# Altium project jarvis.PrjPcb
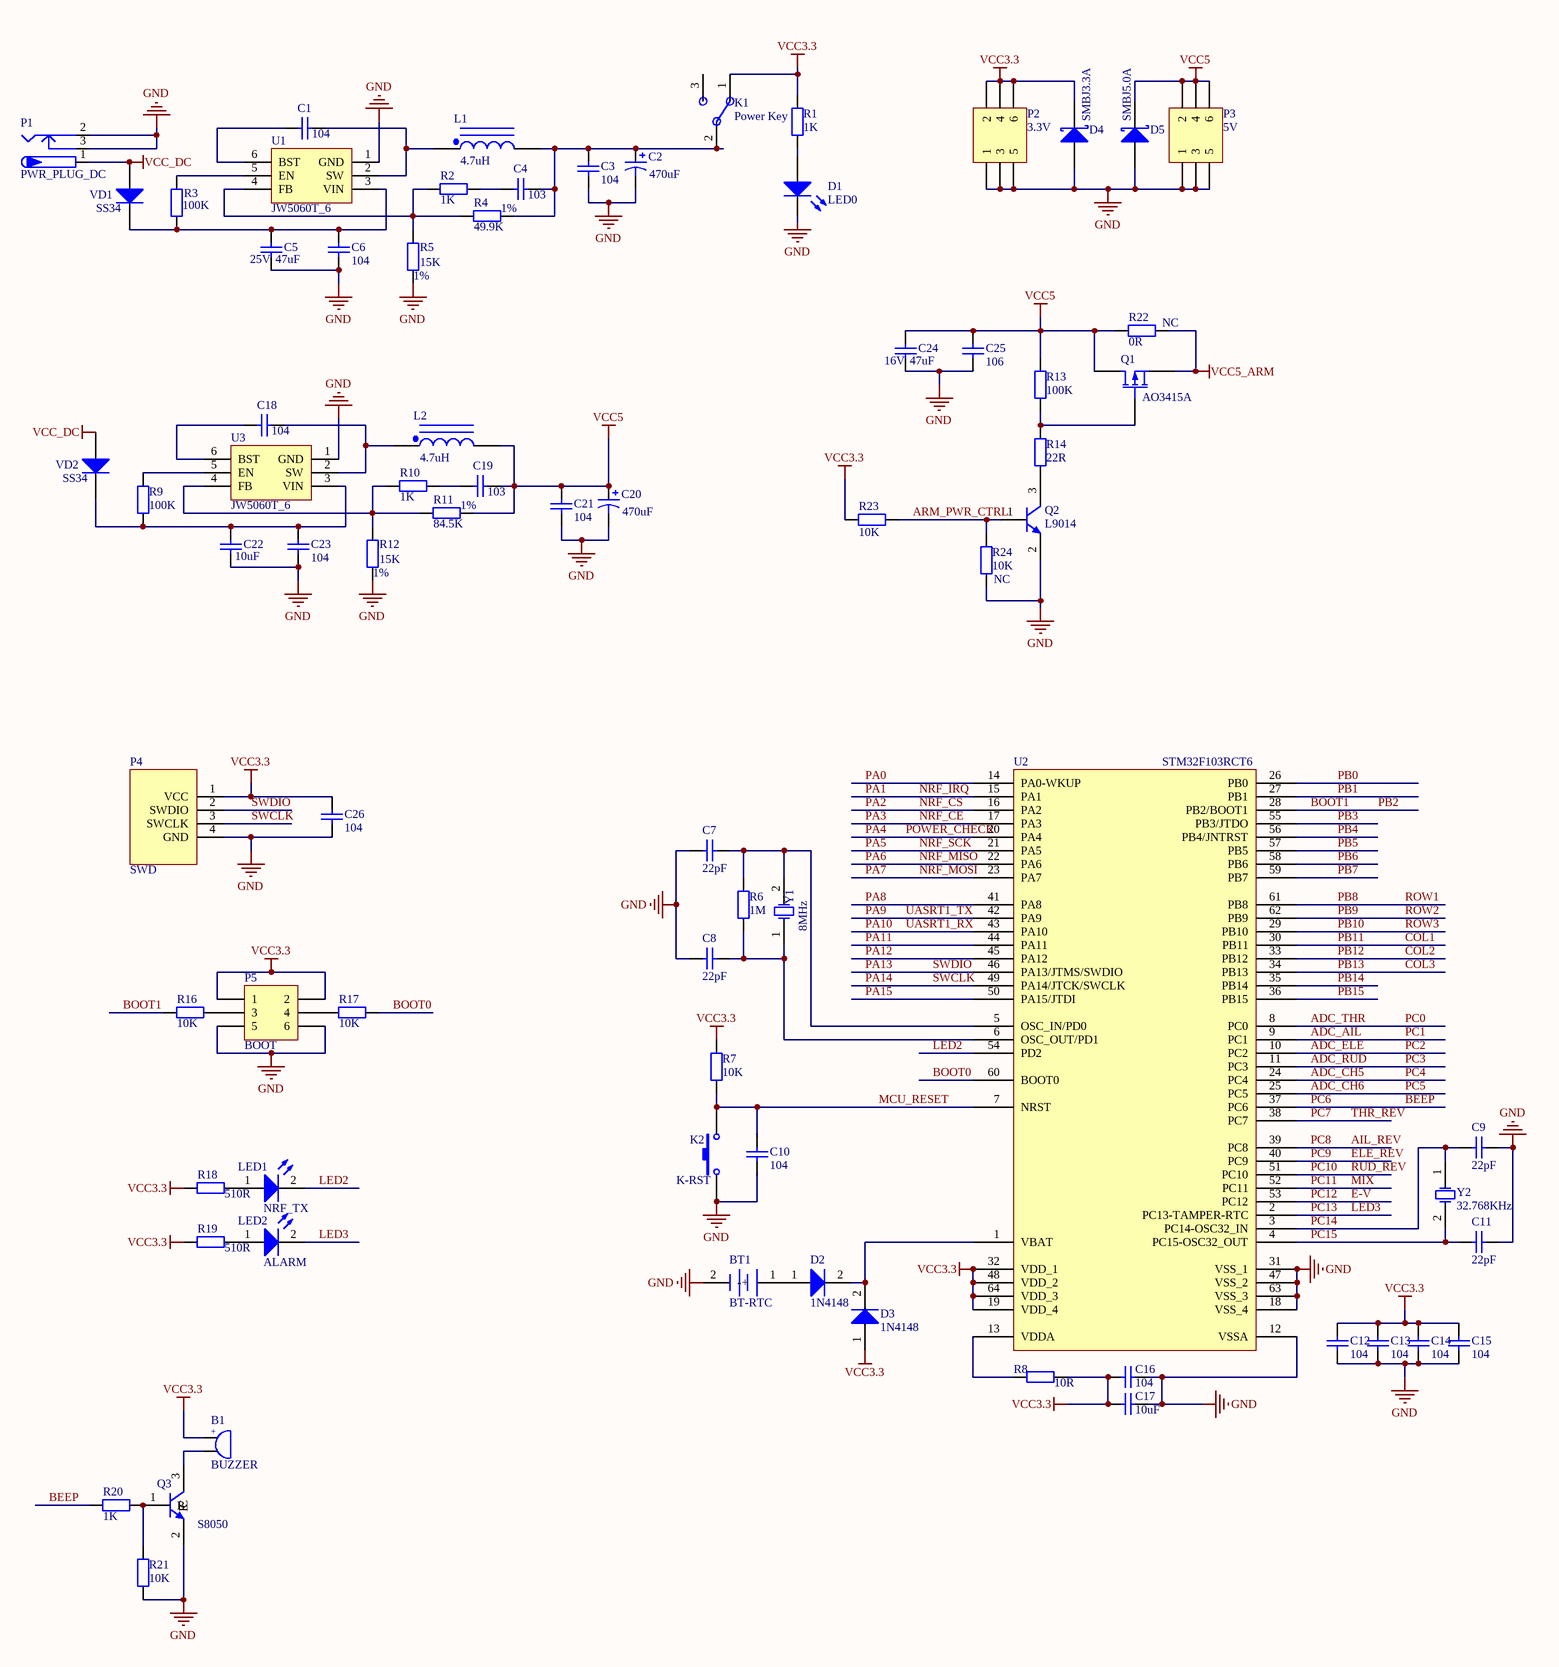
[diagram p0: mcu.SchDoc]
1 sheet, 77 parts. Net scope: global (net labels, ports and power ports of the same name join across sheets).

## Sheet mcu.SchDoc
size A2

### Parts
B1  BUZZER  [BEEP 5x9x5.5]
BT1  BT-RTC  [BAT-RTC]
C1  value 104  [RAD-0.3]  (hidden comment: *)
C2  value 470uF  [RB7.6-15]  (hidden comment: Cap Pol1)
C3  value 104  [RAD-0.3]  (hidden comment: *)
C4  value 103  [RAD-0.3]  (hidden comment: *)
C5  25V  value 47uF  [RAD-0.3]
C6  value 104  [RAD-0.3]  (hidden comment: *)
C7  value 22pF  [0805]  (hidden comment: Cap)
C8  value 22pF  [0805]  (hidden comment: Cap)
C9  value 22pF  [0805]  (hidden comment: Cap)
C10  value 104  [0805]  (hidden comment: Cap)
C11  value 22pF  [0805]  (hidden comment: Cap)
C12  value 104  [0805]  (hidden comment: Cap)
C13  value 104  [0805]  (hidden comment: Cap)
C14  value 104  [0805]  (hidden comment: Cap)
C15  value 104  [0805]  (hidden comment: Cap)
C16  value 104  [0805]  (hidden comment: Cap)
C17  value 10uF  [0805]  (hidden comment: Cap)
C18  value 104  [RAD-0.3]  (hidden comment: *)
C19  value 103  [RAD-0.3]  (hidden comment: *)
C20  value 470uF  [RB7.6-15]  (hidden comment: Cap Pol1)
C21  value 104  [RAD-0.3]  (hidden comment: *)
C22  value 10uF  [RAD-0.3]
C23  value 104  [RAD-0.3]  (hidden comment: *)
C24  16V  value 47uF  [RAD-0.3]
C25  value 106  [RAD-0.3]  (hidden comment: *)
C26  value 104  [0805]  (hidden comment: Cap)
D1  LED0  [LED-0]
D2  1N4148  [DIODE-1N4148]
D3  1N4148  [DIODE-1N4148]
D4  SMBJ3.3A  [TO-220AC]
D5  SMBJ5.0A  [TO-220AC]
K1  Power Key  [PKEY]
K2  K-RST  [KEY]
L1  value 4.7uH  [DIODE_SMC]  (hidden comment: Inductor Iron Dot)
L2  value 4.7uH  [DIODE_SMC]  (hidden comment: Inductor Iron Dot)
LED1  NRF_TX  [LED]
LED2  ALARM  [LED]
P1  PWR_PLUG_DC  [DC10B]
P2  3.3V  [HDR2X3]
P3  5V  [HDR2X3]
P4  SWD
P5  BOOT  [HDR2X3]
Q1  AO3415A  [E3]
Q2  L9014
Q3  S8050  [S8050]
R1  value 1K  [AXIAL-0.4]  (hidden comment: *)
R2  value 1K  [AXIAL-0.4]  (hidden comment: *)
R3  value 100K  [AXIAL-0.4]  (hidden comment: *)
R4  1%  value 49.9K  [AXIAL-0.4]
R5  1%  value 15K  [AXIAL-0.4]
R6  value 1M  [0805]  (hidden comment: Res2)
R7  value 10K  [0805]  (hidden comment: Res2)
R8  value 10R  [0805]  (hidden comment: Res2)
R9  value 100K  [AXIAL-0.4]  (hidden comment: *)
R10  value 1K  [AXIAL-0.4]  (hidden comment: *)
R11  1%  value 84.5K  [AXIAL-0.4]
R12  1%  value 15K  [AXIAL-0.4]
R13  value 100K  [AXIAL-0.4]
R14  value 22R  [AXIAL-0.4]  (hidden comment: *)
R16  value 10K  [0805]  (hidden comment: Res2)
R17  value 10K  [0805]  (hidden comment: Res2)
R18  value 510R  [0805]  (hidden comment: Res2)
R19  value 510R  [0805]  (hidden comment: Res2)
R20  value 1K  [0805]  (hidden comment: Res2)
R21  value 10K  [0805]  (hidden comment: Res2)
R22  NC  value 0R  [AXIAL-0.4]
R23  value 10K  [AXIAL-0.4]  (hidden comment: *)
R24  NC  value 10K  [AXIAL-0.4]
U1  JW5060T_6
U2  STM32F103RCT6  [STM32F103RCT6]
U3  JW5060T_6
VD1  SS34  [SMC]
VD2  SS34  [SMC]
Y1  8MHz  [CRYSTAL-8M]
Y2  32.768KHz  [CRYSTAL-RTC]

### Nets
GND: BT1.2(-) C2.2 C3.1 C5.1 C6.1 C7.2 C8.2 C9.2 C10.1 C11.2 C12.1 C13.1 C14.1 C15.1 C16.1 C17.1 C20.2 C21.1 C22.1 C23.1 C24.1 C25.1 C26.1 D1.2(K) D4.3(A) D5.3(A) K2.1 P1.2 P1.3 P2.1 P2.3 P2.5 P3.1 P3.3 P3.5 P4.4(GND) P5.5 P5.6 Q2.2(E) Q3.2(E) R5.1 R12.1 R21.1 R24.2 U1.1(GND) U2.12(VSSA) U2.18(VSS_4) U2.31(VSS_1) U2.47(VSS_2) U2.63(VSS_3) U3.1(GND)
VCC3.3: B1.1 C12.2 C13.2 C14.2 C15.2 C16.2 C17.2 C26.2 D3.1(A) D4.1(K) K1.1 P2.2 P2.4 P2.6 P4.1(VCC) P5.1 P5.2 R1.1 R7.2 R8.1 R18.1 R19.1 R23.2 U2.19(VDD_4) U2.32(VDD_1) U2.48(VDD_2) U2.64(VDD_3)
VCC5: C19.2 C20.1 C21.2 C24.2 C25.2 D5.1(K) L2.2 P3.2 P3.4 P3.6 Q1.1(D) R11.1 R13.1 R22.1
VCC5_ARM: Q1.3(S) R22.2
VCC_DC: P1.1 VD1.1(A) VD2.1(A)
ADC_AIL: U2.9(PC1)  [also labelled PC1]
ADC_CH5: U2.24(PC4)  [also labelled PC4]
ADC_CH6: U2.25(PC5)  [also labelled PC5]
ADC_ELE: U2.10(PC2)  [also labelled PC2]
ADC_RUD: U2.11(PC3)  [also labelled PC3]
ADC_THR: U2.8(PC0)  [also labelled PC0]
AIL_REV: U2.39(PC8)  [also labelled PC8]
ARM_PWR_CTRL: Q2.1(B) R23.1 R24.1
BEEP: R20.1 U2.37(PC6)  [also labelled PC6]
BOOT0: R17.1 U2.60(BOOT0)
BOOT1: R16.2 U2.28(PB2/BOOT1)  [also labelled PB2]
COL1: U2.30(PB11)  [also labelled PB11]
COL2: U2.33(PB12)  [also labelled PB12]
COL3: U2.34(PB13)  [also labelled PB13]
E-V: U2.53(PC12)  [also labelled PC12]
ELE_REV: U2.40(PC9)  [also labelled PC9]
LED2: LED1.2(K) U2.54(PD2)
LED3: LED2.2(K) U2.2(PC13-TAMPER-RTC)  [also labelled PC13]
MCU_RESET: C10.2 K2.2 R7.1 U2.7(NRST)
MIX: U2.52(PC11)  [also labelled PC11]
NRF_CE: U2.17(PA3)  [also labelled PA3]
NRF_CS: U2.16(PA2)  [also labelled PA2]
NRF_IRQ: U2.15(PA1)  [also labelled PA1]
NRF_MISO: U2.22(PA6)  [also labelled PA6]
NRF_MOSI: U2.23(PA7)  [also labelled PA7]
NRF_SCK: U2.21(PA5)  [also labelled PA5]
PA0: U2.14(PA0-WKUP)
PA4: U2.20(PA4)  [also labelled POWER_CHECK]
PA8: U2.41(PA8)
PA9: U2.42(PA9)  [also labelled UASRT1_TX]
PA10: U2.43(PA10)  [also labelled UASRT1_RX]
PA11: U2.44(PA11)
PA12: U2.45(PA12)
PA13: P4.2(SWDIO) U2.46(PA13/JTMS/SWDIO)  [also labelled SWDIO]
PA14: P4.3(SWCLK) U2.49(PA14/JTCK/SWCLK)  [also labelled SWCLK]
PA15: U2.50(PA15/JTDI)
PB0: U2.26(PB0)
PB1: U2.27(PB1)
PB3: U2.55(PB3/JTDO)
PB4: U2.56(PB4/JNTRST)
PB5: U2.57(PB5)
PB6: U2.58(PB6)
PB7: U2.59(PB7)
PB8: U2.61(PB8)  [also labelled ROW1]
PB9: U2.62(PB9)  [also labelled ROW2]
PB10: U2.29(PB10)  [also labelled ROW3]
PB14: U2.35(PB14)
PB15: U2.36(PB15)
PC7: U2.38(PC7)  [also labelled THR_REV]
PC10: U2.51(PC10)  [also labelled RUD_REV]
PC14: C9.1 U2.3(PC14-OSC32_IN) Y2.1(OSC1)
PC15: C11.1 U2.4(PC15-OSC32_OUT) Y2.2(OSC2)
NetB1_2: B1.2 Q3.3(C)
NetBT1_1: BT1.1(+) D2.1(A)
NetC1_1: C1.1 U1.6(BST)
NetC1_2: C1.2 L1.1 U1.2(SW)
NetC2_1: C2.1 C3.2 C4.2 K1.2 L1.2 R4.1
NetC4_1: C4.1 R2.1
NetC5_2: C5.2 C6.2 R3.1 U1.3(VIN) VD1.2(K)
NetC7_1: C7.1 R6.1 U2.5(OSC_IN/PD0) Y1.2(OSC2)
NetC8_1: C8.1 R6.2 U2.6(OSC_OUT/PD1) Y1.1(OSC1)
NetC18_1: C18.1 U3.6(BST)
NetC18_2: C18.2 L2.1 U3.2(SW)
NetC19_1: C19.1 R10.1
NetC22_2: C22.2 C23.2 R9.2 U3.3(VIN) VD2.2(K)
NetD1_1: D1.1(A) R1.2
NetD2_2: D2.2(K) D3.2(K) U2.1(VBAT)
NetLED1_1: LED1.1(A) R18.2
NetLED2_1: LED2.1(A) R19.2
NetP5_3: P5.3 R16.1
NetP5_4: P5.4 R17.2
NetQ1_2: Q1.2(G) R13.2 R14.1
NetQ2_3: Q2.3(C) R14.2
NetQ3_1: Q3.1(B) R20.2 R21.2
NetR2_2: R2.2 R4.2 R5.2 U1.4(FB)
NetR3_2: R3.2 U1.5(EN)
NetR8_2: R8.2 U2.13(VDDA)
NetR9_1: R9.1 U3.5(EN)
NetR10_2: R10.2 R11.2 R12.2 U3.4(FB)

Not connected (* = marked no-connect by the designer): K1 3

### Notes on the sheet
- (in symbol BUZZER) +

### Library data of the parts
B1 = BUZZER: BOM名称: 蜂鸣器; 版权归属: 源创客; 学习资源: www.ooocke.com
BT1 = Battery: Multicell Battery; Published: 24-Mar-1999; LatestRevisionDate: 17-Jul-2002; LatestRevisionNote: Re-released for DXP Platform.; PackageReference: BAT-2; Publisher: Altium Limited; PackageDescription: Battery; 2 Leads
C1 C3-C19 C21-C26 = Cap: Capacitor; Published: 8-Jun-2000; LatestRevisionDate: 17-Jul-2002; LatestRevisionNote: Re-released for DXP Platform.; PackageReference: RAD-0.3; Publisher: Altium Limited; PackageDescription: Radial Cap, Thru-Hole; 2 Leads; 0.3 in Pin Spacing
C2 C20 = Cap Pol1: Polarized Capacitor (Radial); Published: 8-Jun-2000; LatestRevisionDate: 17-Jul-2002; LatestRevisionNote: Re-released for DXP Platform.; PackageReference: RB7.6-15; Publisher: Altium Limited; PackageDescription: Polarized Capacitor (Radial); 2 Leads
D1 LED1 LED2 = LED0: Typical INFRARED GaAs LED; Published: 8-Jun-2000; LatestRevisionDate: 08-Jul-2005; LatestRevisionNote: Mech Layer 1 removed.; PackageReference: LED-0; Publisher: Altium Limited; PackageDescription: LED; 2 Leads
D2 D3 VD1 VD2 = Diode: Default Diode; Published: 8-Jun-2000; LatestRevisionDate: 17-Jul-2002; LatestRevisionNote: Re-released for DXP Platform.; PackageVersion: Sep-1996; PackageReference: SMC; Publisher: Altium Limited; PackageDescription: DO-214-AB/SMC; 2 C-Bend Leads; Body 7.9 x 5.9 mm, inc. leads (LxW); Code_JEDEC: DO-214-AB
D4 D5 = Diode 10TQ035: Schottky Rectifier; Note: Terminal 2 is the TAB and is electrically connected to the cathode; Published: 8-Jun-2000; LatestRevisionDate: 17-Jul-2002; LatestRevisionNote: Re-released for DXP Platform.; DatasheetVersion: PD-2.057B; PackageVersion: Feb-1998; PackageReference: TO-220AC; Publisher: Altium Limited; PackageDescription: TO, Thru-Hole, Vertical, Heatsink Mounted; 3 In-Line Leads (1 Absent); Pitch 2.54 mm; ComponentLink1Description: Manufacturer Link; ComponentLink1URL: http://www.irf.com/; ComponentLink2Description: Datasheet; ComponentLink2URL: http://www.irf.com/product-info/datasheets/data/10tq.pdf
K1 = PWR_KEY
K2 = SW-PB: Switch; Published: 24-Mar-1999; LatestRevisionDate: 17-Jul-2002; LatestRevisionNote: Re-released for DXP Platform.; PackageReference: SPST-2; Publisher: Altium Limited; PackageDescription: Switch; 2 Leads
L1 L2 = Inductor Iron Dot: Magnetic-Core Inductor with Winding Polarity Marking; Published: 24-Mar-1999; LatestRevisionDate: 17-Jul-2002; LatestRevisionNote: Re-released for DXP Platform.; PackageReference: DIODE_SMC; Publisher: Altium Limited; PackageDescription: Diode; 2 Leads
P1 = PWR_PLUG_DC: BOM名称: DC电源接口; 版权归属: 源创客; 学习资源: www.ooocke.com
P2 P3 P5 = Header 3X2: Header, 3-Pin, Dual row; LatestRevisionDate: 17-Jul-2002; LatestRevisionNote: Re-released for DXP Platform.; Publisher: Altium Limited
Q1 = MOSFET-P: P-Channel MOSFET; Published: 8-Jun-2000; LatestRevisionDate: 17-Jul-2002; LatestRevisionNote: Re-released for DXP Platform.; PackageVersion: 1995/1996; PackageReference: E3; Publisher: Altium Limited; PackageDescription: TO, Flat Index; 3 In-Line, Axial Leads; Body Dia. 4.6mm; Lead Dia. 0.5 mm (max)
Q2 = TRIODE_NPN
R1-R14 R16-R24 = Res2: Resistor; Published: 8-Jun-2000; LatestRevisionDate: 17-Jul-2002; LatestRevisionNote: Re-released for DXP Platform.; PackageReference: AXIAL-0.4; Publisher: Altium Limited; PackageDescription: Axial Device, Thru-Hole; 2 Leads; 0.4 in Pin Spacing
U1 U3 = JW5060T_6: 电源稳压芯片，类似LDO。
Y1 Y2 = XTAL: Crystal Oscillator; Published: 8-Jun-2000; LatestRevisionDate: 17-Jul-2002; LatestRevisionNote: Re-released for DXP Platform.; PackageReference: R38; Publisher: Altium Limited; PackageDescription: Crystal, Thru-Hole; 2 Leads; Body 3.1 x 8.2 mm (Dia.xH)